# EAGLE design LCD (EAGLE 6.5.0)
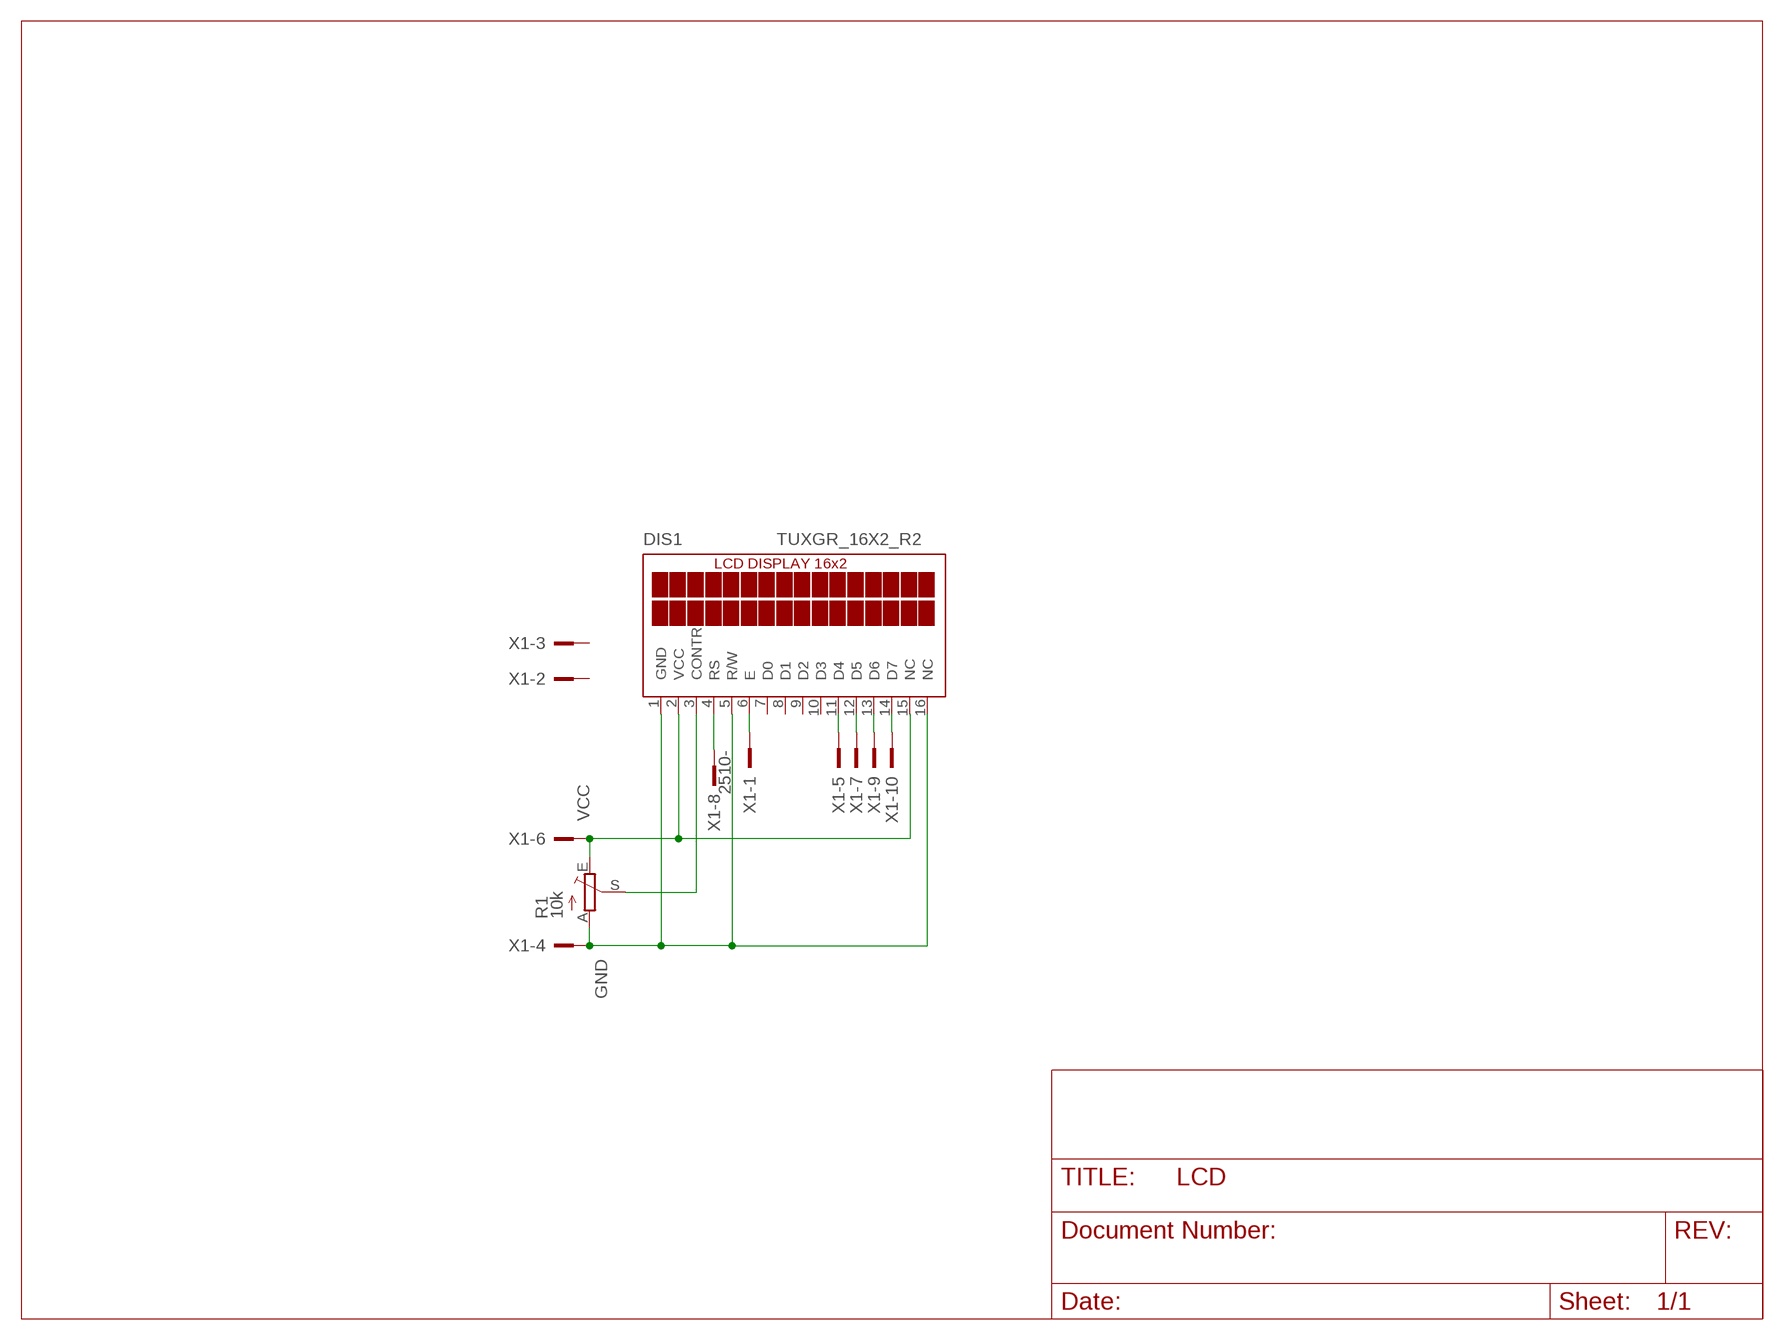
[diagram p0: schematic, sheet 1]

## Parts
DIS1  TUXGR_16X2_R2  [TUXGR_16X2_R2]
R1  10k  TRIM_EU-RS3  [RS3]
X1  2510-  [PAK100/2500-10]

## Nets
GND: DIS1.1(GND) DIS1.5(R/W) DIS1.16(NC) R1.A X1.4
N$3: DIS1.13(D6) X1.9
N$4: DIS1.14(D7) X1.10
N$5: DIS1.11(D4) X1.5
N$6: DIS1.12(D5) X1.7
N$7: DIS1.4(RS) X1.8
N$10: DIS1.3(CONTR) R1.S
N$11: DIS1.6(E) X1.1
VCC: DIS1.2(VCC) DIS1.15(NC) R1.E X1.6
Unconnected: DIS1.7(D0) DIS1.8(D1) DIS1.9(D2) DIS1.10(D3) X1.2 X1.3

## Library data of the parts
DIS1 = display-lcd:TUXGR_16X2_R2: Tuxgraphics LCD display 16x2 characters reflective, without background light Source: tuxgr_12x2_r2.pdf; OC_FARNELL: unknown; OC_NEWARK: unknown
R1 = pot:TRIM_EU-: POTENTIOMETER
X1 = con-3m:2510-: 3M (TM) Pak 100 4-Wall Header Source: 3M; MF: 3M; MPN: 2510-6002UB; OC_FARNELL: 9838244; OC_NEWARK: 46F4725

## Board
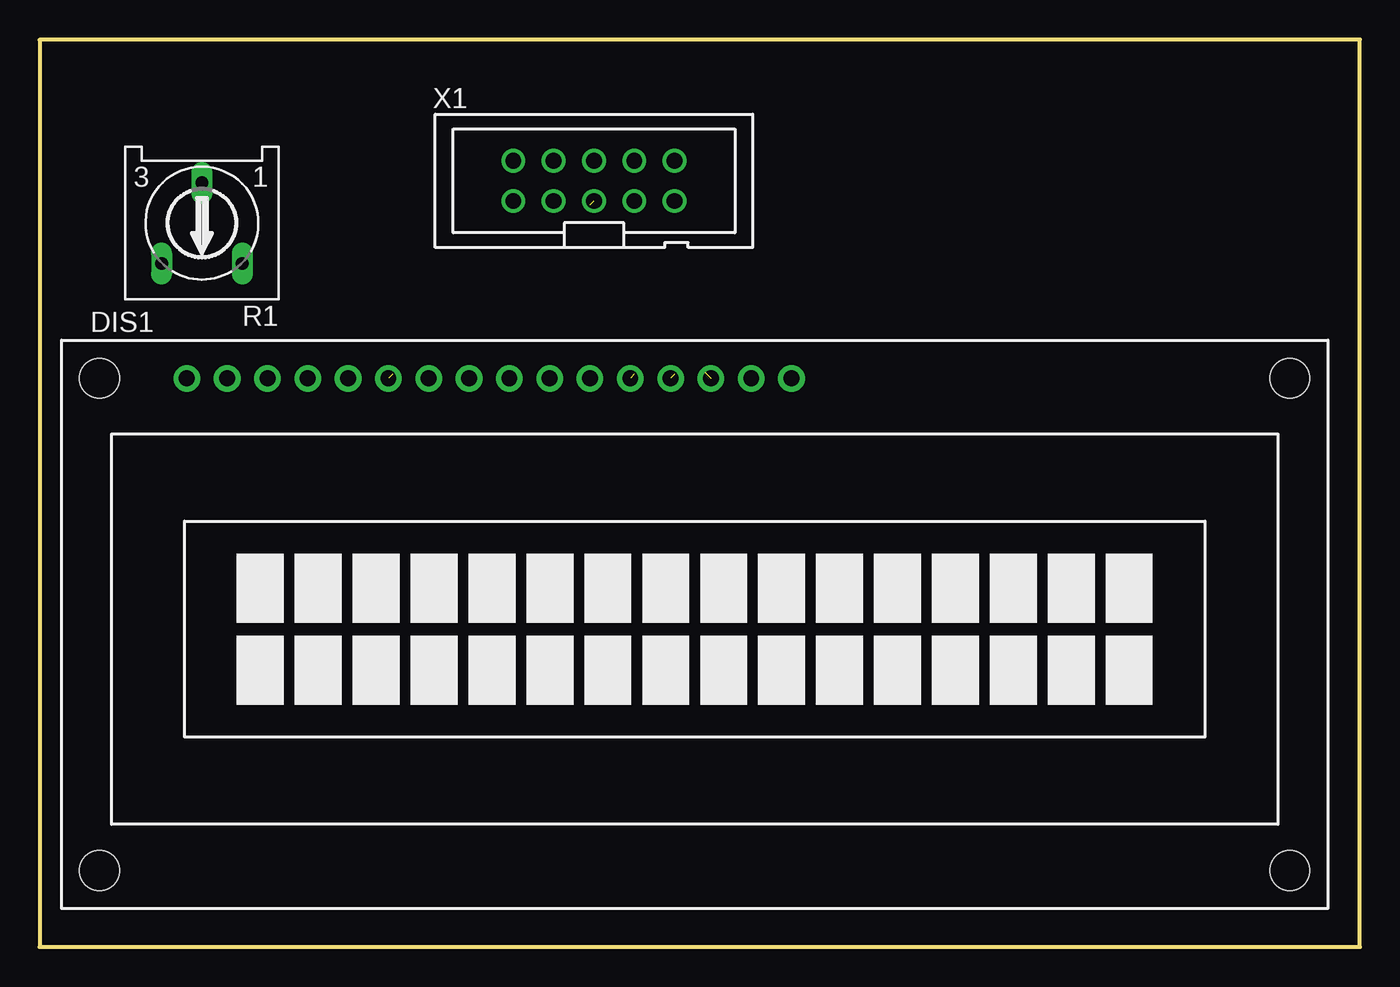
[diagram p1: board, top side]
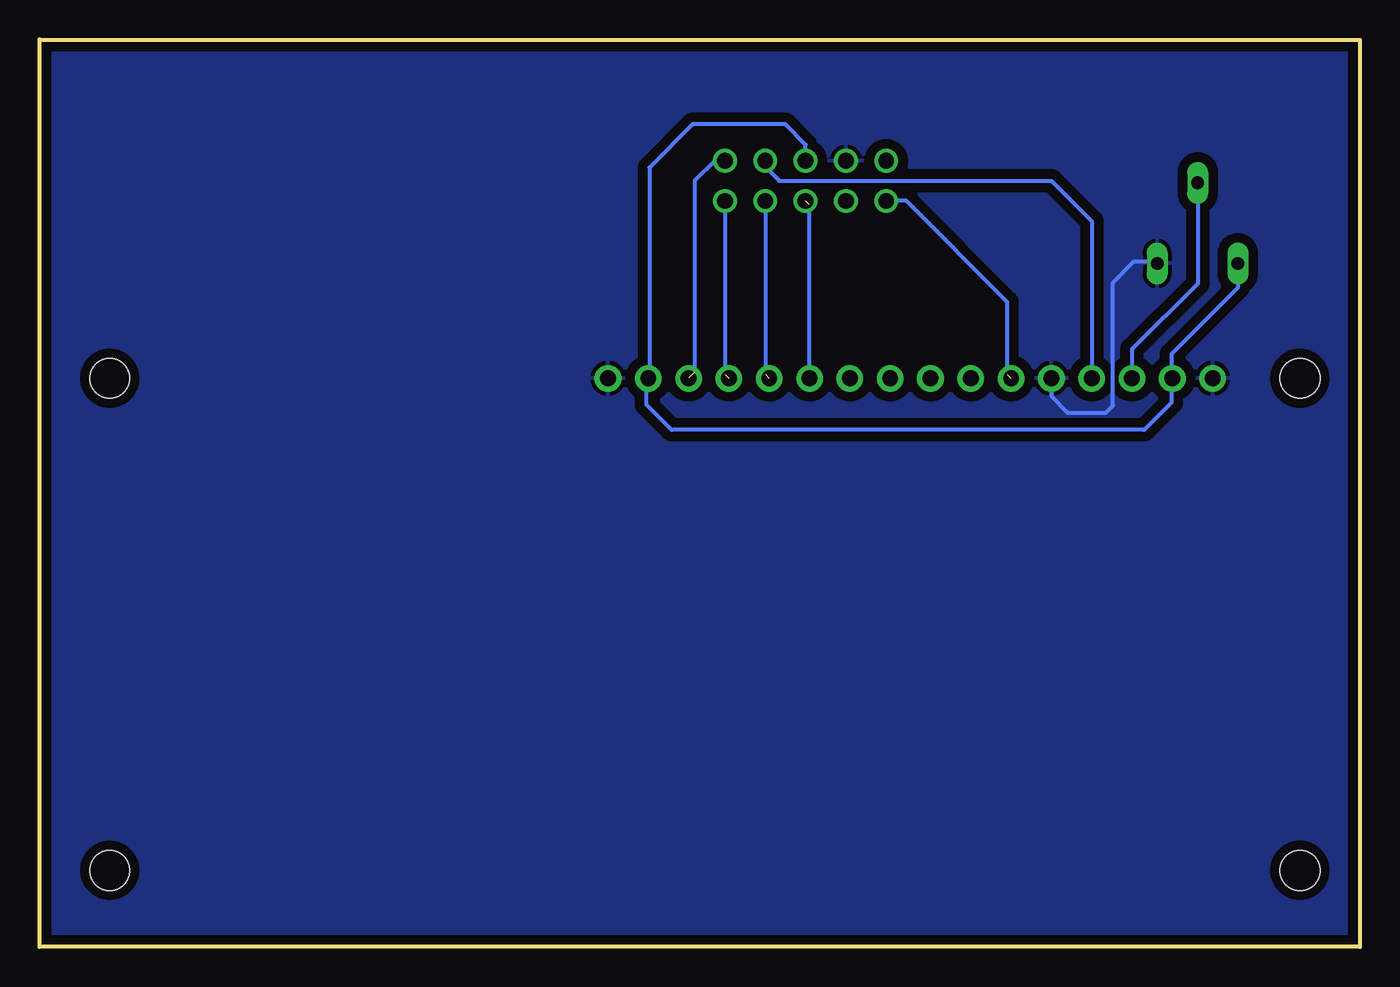
[diagram p2: board, bottom side, seen from below]

Size 83.19 x 57.15 mm. Coordinates in mm from the lower left corner, seen from the top.
Outline: 0,0 83.19,0 83.19,57.15 0,57.14 0,0
Copper layers (1*16): Top 0.035mm / dielectric 1.5mm / Bottom 0.035mm
Design rules "default *": minimum track width 10mil, minimum drill 24mil, track to track 12mil, track to pad 12mil, pad to pad 12mil, via to via 12mil, smd to smd 8mil, copper to edge 16mil, drill to drill 8mil, minimum pad ring 10mil, minimum via ring 8mil, stop-mask expansion 4mil, vias tented up to drill 0mil, thermal gap 10mil

### Footprints (pad centres in the part's own frame; a part is rotated, then mirrored left to right if it is on the bottom)
TUXGR_16X2_R2 = drill 1 pad 1.676: 1 -32,15.5; 2 -29.46,15.5; 3 -26.92,15.5; 4 -24.38,15.5; 5 -21.84,15.5; 6 -19.3,15.5; 7 -16.76,15.5; 8 -14.22,15.5; 9 -11.68,15.5; 10 -9.14,15.5; 11 -6.6,15.5; 12 -4.06,15.5; 13 -1.52,15.5; 14 1.02,15.5; 15 3.56,15.5; 16 6.1,15.5 | hole 2.5: -37.5,-15.5; 37.5,-15.5; -37.5,15.5; 37.5,15.5
RS3 = drill 0.813 long: A -2.54,2.54; E 2.54,2.54; S 0,-2.54
PAK100/2500-10 = drill 1 pad 1.422: 1 -5.08,-1.27; 2 -5.08,1.27; 3 -2.54,-1.27; 4 -2.54,1.27; 5 0,-1.27; 6 0,1.27; 7 2.54,-1.27; 8 2.54,1.27; 9 5.08,-1.27; 10 5.08,1.27

### Placement (x,y rotation side)
DIS1  41.27,20.32 0 top
R1  10.22,45.59 180 top
X1  34.92,48.26 0 top

### Tracks (layer width: path | path; a pad name or v marks a point on that pad's centre or on a via)
GND
  Bottom 0.254: DIS1.5 19.43,34.67 18.41,33.66 16,33.66 15.56,34.1 15.56,41.85 14.22,43.18 12.89,43.18 R1.A
  pour Bottom (isolate 0.61): 0,57.15 83.19,57.15 83.19,0 0,0
N$3  (1 unrouted)
  Bottom 0.254: X1.9 40.01,36.07
N$4  (1 unrouted)
  Bottom 0.254: X1.10 40.64,49.53 41.91,48.26 41.91,36.2
N$5  (1 unrouted)
  Bottom 0.254: DIS1.11 34.67,46.74
N$6  (1 unrouted)
  Bottom 0.254: X1.7 37.47,36.07
N$7
  Bottom 0.254: X1.8 37.47,49.15 36.58,48.26 19.43,48.26 16.89,45.72 DIS1.4
N$10
  Bottom 0.254: R1.S 10.22,41.78 14.35,37.66 DIS1.3
N$11  (1 unrouted)
  Bottom 0.254: 22.23,36.07 22.23,40.64 28.57,46.99 X1.1
VCC
  Bottom 0.254: R1.E 7.68,41.53 11.87,37.34 11.87,35.88 | 11.87,35.88 DIS1.2 | 11.87,35.88 11.87,34.29 13.59,32.58 43.37,32.58 44.96,34.16 44.96,35.7 DIS1.15 44.77,35.89 44.77,49.09 42.04,51.82 36.2,51.82 34.92,50.55 X1.6